# EAGLE schematic shield v1 (EAGLE 5.07)
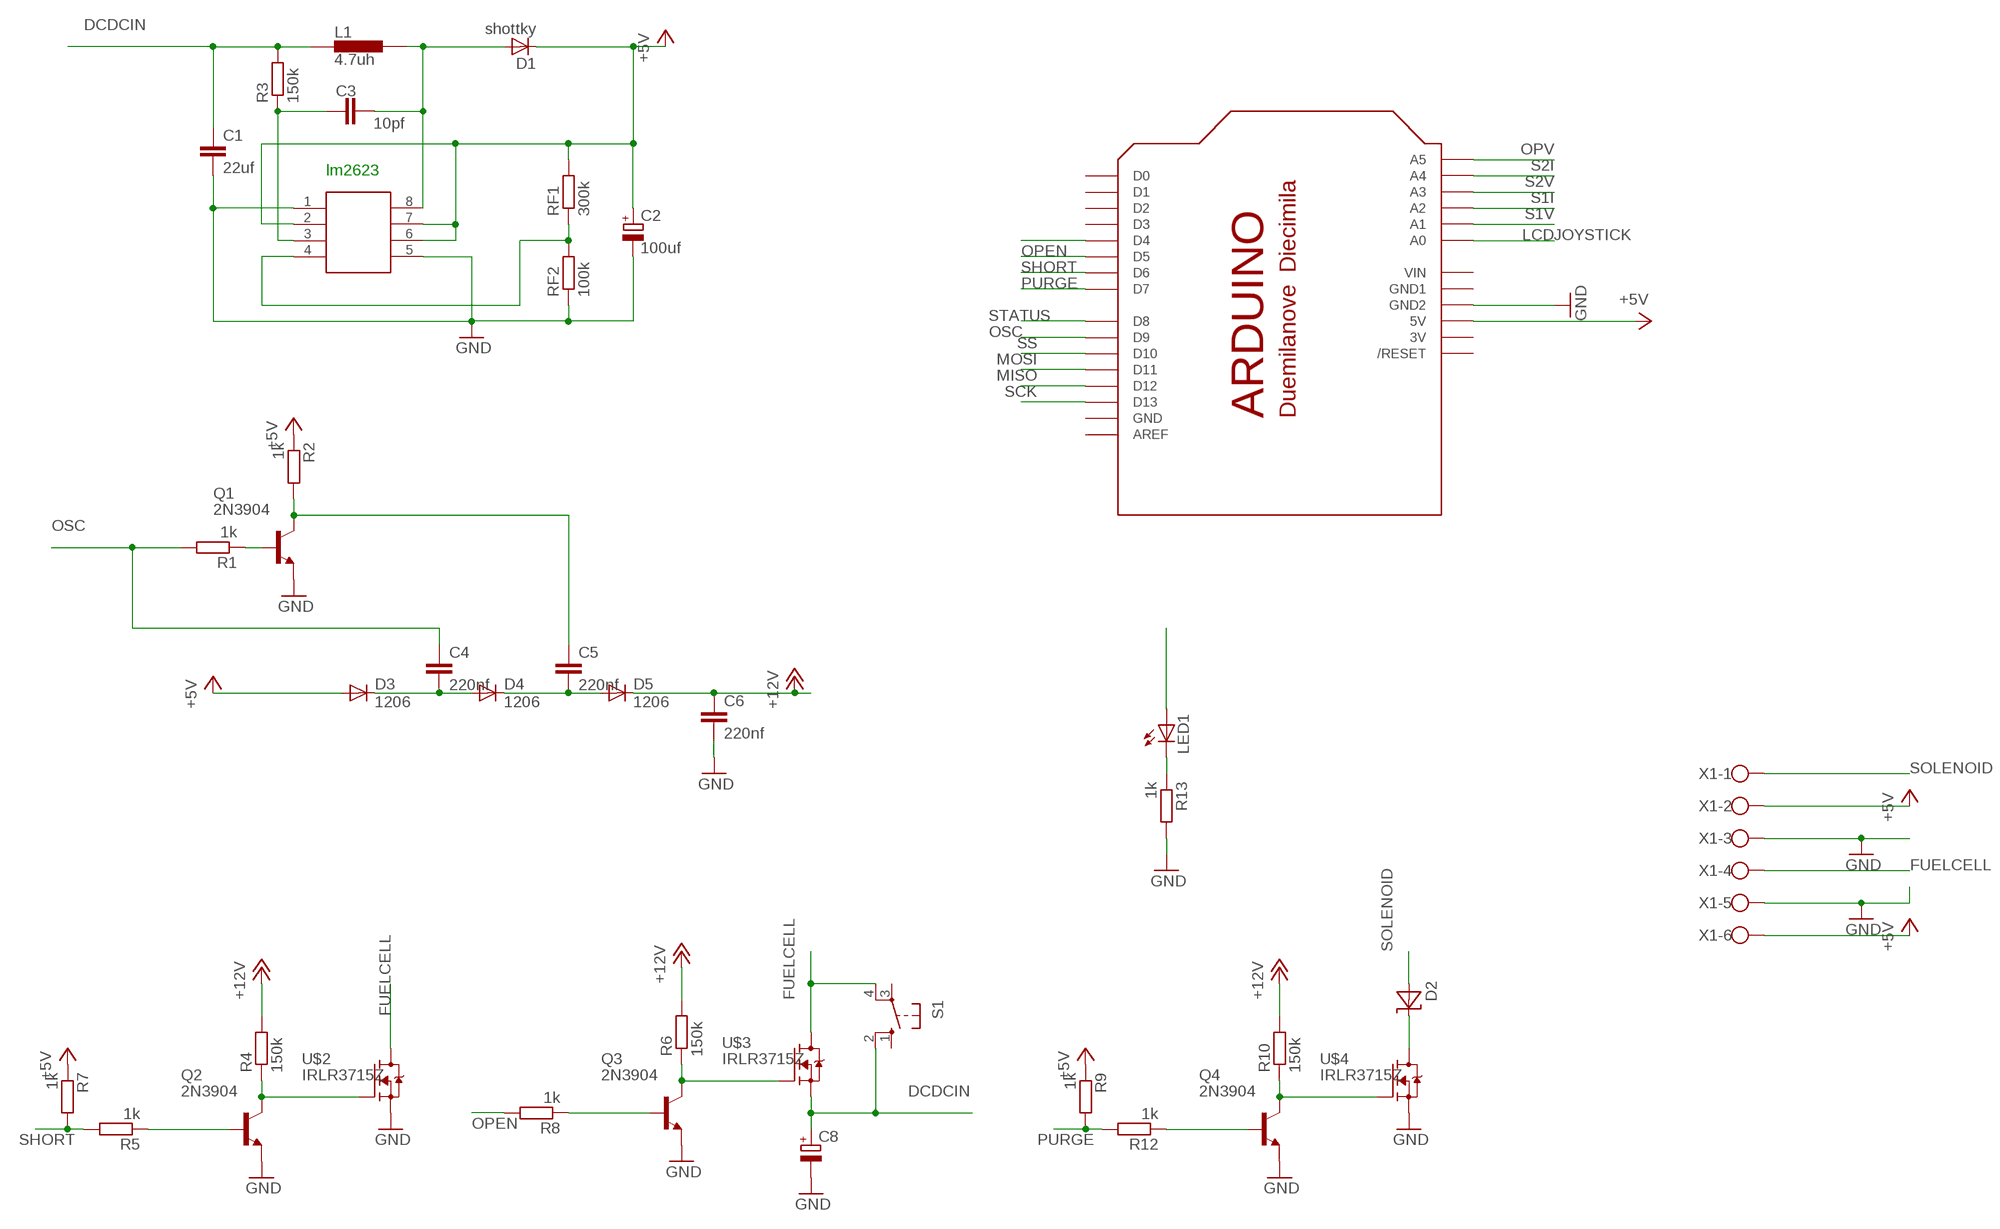
[diagram p0: schematic, sheet 1]

## Parts
C1  22uf  C-EUC1206  [C1206]
C2  100uf  CPOL-EUD  [PANASONIC_D]
C3  10pf  C-EUC1206  [C1206]
C4  220nf  C-EUC1206  [C1206]
C5  220nf  C-EUC1206  [C1206]
C6  220nf  C-EUC1206  [C1206]
C8  CPOL-EUE5-10.5  [E5-10,5]
D1  shottky  BYS10  [SOD106A]
D2  1206ZENER  [C1206]
D3  1206  [C1206]
D4  1206  [C1206]
D5  1206  [C1206]
L1  4.7uh  SMT-INDUCTOR  [SMT-INDUCTOR]
LED1  LED5MM  [LED5MM]
LM2623  lm2623  MINI-SO  [MINI-SO]
Q1  2N3904  [TO92]
Q2  2N3904  [TO92]
Q3  2N3904  [TO92]
Q4  2N3904  [TO92]
R1  1k  R-EU_M1206  [M1206]
R2  1k  R-EU_M1206  [M1206]
R3  150k  R-EU_M1206  [M1206]
R4  150k  R-EU_M1206  [M1206]
R5  1k  R-EU_M1206  [M1206]
R6  150k  R-EU_M1206  [M1206]
R7  1k  R-EU_M1206  [M1206]
R8  1k  R-EU_M1206  [M1206]
R9  1k  R-EU_M1206  [M1206]
R10  150k  R-EU_M1206  [M1206]
R12  1k  R-EU_M1206  [M1206]
R13  1k  R-EU_M1206  [M1206]
RF1  300k  R-EU_M1206  [M1206]
RF2  100k  R-EU_M1206  [M1206]
S1  10-XX  [B3F-10XX]
U$1  ARDUINO-BPLACE  [ARDUINO-BPLACE]
U$2  IRLR3715Z  [TO252]
U$3  IRLR3715Z  [TO252]
U$4  IRLR3715Z  [TO252]
X1  W237-6  [W237-6]

## Nets
+5V: C2.+ D1.K D3.ANODE(A) LM2623.2 LM2623.6 LM2623.7 R2.1 R7.1 R9.1 RF1.2 U$1.5V X1.2 X1.6
+12V: C6.1 D5.CATHODE(C) R4.2 R6.2 R10.2
DCDCIN: C1.1 C8.+ L1.P$2 R3.2 S1.2(S1) U$3.2(S)
FUELCELL: S1.4(P1) U$2.3(D) U$3.3(D) X1.4
GND: C1.2 C2.- C6.2 C8.- LM2623.1 LM2623.5 Q1.3(E) Q2.3(E) Q3.3(E) Q4.3(E) R13.2 RF2.1 U$1.GND2 U$2.2(S) U$4.2(S) X1.3 X1.5
LCDJOYSTICK: U$1.A0
MISO: U$1.D12
MOSI: U$1.D11
N$1: C3.1 LM2623.3 R3.1
N$2: Q4.1(C) R10.1 U$4.1(G)
N$3: LM2623.4 RF1.1 RF2.2
N$4: U$1.D7
N$5: Q2.1(C) R4.1 U$2.1(G)
N$6: C4.2 D3.CATHODE(C) D4.ANODE(A)
N$7: C5.2 D4.CATHODE(C) D5.ANODE(A)
N$8: Q4.2(B) R12.1
N$9: C3.2 D1.A L1.P$3 LM2623.8
N$10: D2.CATHODE(C) U$4.3(D)
N$11: C5.1 Q1.1(C) R2.2
N$12: Q1.2(B) R1.1
N$13: Q3.1(C) R6.1 U$3.1(G)
N$14: Q2.2(B) R5.1
N$15: LED1.K(C) R13.1
N$16: Q3.2(B) R8.1
OPEN: R8.2 U$1.D4
OPV: U$1.A5
OSC: C4.1 R1.2 U$1.D9
PURGE: R9.2 R12.2 U$1.D6
S1I: U$1.A2
S1V: U$1.A1
S2I: U$1.A4
S2V: U$1.A3
SCK: U$1.D13
SHORT: R5.2 R7.2 U$1.D5
SOLENOID: D2.ANODE(A) X1.1
SS: U$1.D10
STATUS: LED1.A U$1.D8
Unconnected: S1.1(S) S1.3(P) U$1.AREF U$1.D0 U$1.D1 U$1.D2 U$1.D3 U$1.RESET(/RESET)

## Notes on the sheet
- lm2623

## Power pins joined to a net without a drawn wire
3V: U$1.3V
GND: U$1.GND
GND1: U$1.GND1
VIN: U$1.VIN

## Library data of the parts
C1 C4-C6 = resistor:C-EU: CAPACITOR, European symbol
C2 C8 = matt rcl:CPOL-EU: POLARIZED CAPACITOR, European symbol
C3 = matt rcl:C-EU: CAPACITOR, European symbol
D1 = telefunken:BYS10: DIODE
D2 = matt diode:1206ZENER
D3-D5 = matt diode:1206
L1 = matt:SMT-INDUCTOR
LED1 = matt led:LED: LED OSRAM: - CHIPLED LG R971, LG N971, LY N971, LG Q971, LY Q971, LO R971, LY R971 LH N974, LH R974 LS Q976, LO Q976, LY Q976 LO Q996 - Hyper CHIPLED LW Q18S LB Q993, LB Q99A, LB R99A - SideLED LS A670, LO A670, LY A670, LG A670, LP A670 LB A673, LV A673, LT A673, LW A673 LH A674 LY A675 LS A676, LA A676, LO A676, LY A676, LW A676 LS A679, LY A679, LG A679 - Hyper Micro SIDELED® LS Y876, LA Y876, LO Y876, LY Y876 LT Y87S - SmartLED LW L88C, LW L88S LB L89C, LB L89S, LG L890 LS L89K, LO L89K, LY L89K LS L896, LA L896, LO L896, LY L896 - TOPLED LS T670, LO T670, LY T670, LG T670, LP T670 LSG T670, LSP T670, LSY T670, LOP T670, LYG T670 LG T671, LOG T671, LSG T671 LB T673, LV T673, LT T673, LW T673 LH T674 LS T676, LA T676, LO T676, LY T676, LB T676, LH T676, LSB T676, LW T676 LB T67C, LV T67C, LT T67C, LS T67K, LO T67K, LY T67K, LW E67C LS E67B, LA E67B, LO E67B, LY E67B, LB E67C, LV E67C, LT E67C LW T67C LS T679, LY T679, LG T679 LS T770, LO T770, LY T770, LG T770, LP T770 LB T773, LV T773, LT T773, LW T773 LH T774 LS E675, LA E675, LY E675, LS T675 LS T776, LA T776, LO T776, LY T776, LB T776 LHGB T686 LT T68C, LB T68C - Hyper Mini TOPLED® LB M676 - Mini TOPLED Santana® LG M470 LS M47K, LO M47K, LY M47K Source: http://www.osram.convergy.de LUXEON: - LUMILED® LXK2-PW12-R00, LXK2-PW12-S00, LXK2-PW14-U00, LXK2-PW14-V00 LXK2-PM12-R00, LXK2-PM12-S00, LXK2-PM14-U00 LXK2-PE12-Q00, LXK2-PE12-R00, LXK2-PE12-S00, LXK2-PE14-T00, LXK2-PE14-U00 LXK2-PB12-K00, LXK2-PB12-L00, LXK2-PB12-M00, LXK2-PB14-N00, LXK2-PB14-P00, LXK2-PB14-Q00 LXK2-PR12-L00, LXK2-PR12-M00, LXK2-PR14-Q00, LXK2-PR14-R00 LXK2-PD12-Q00, LXK2-PD12-R00, LXK2-PD12-S00 LXK2-PH12-R00, LXK2-PH12-S00 LXK2-PL12-P00, LXK2-PL12-Q00, LXK2-PL12-R00 Source: www.luxeon.com KINGBRIGHT: KA-3528ASYC Source: www.kingbright.com
LM2623 = matt smd-special:MINI-SO: Mini-SO generic format
Q1-Q4 = matt transistor-npn:2N3904: NPN Transistor
R1-R10 R12 R13 RF1 RF2 = resistor:R-EU_: RESISTOR, European symbol
S1 = switch-omron:10-XX: OMRON SWITCH
U$1 = adafruit:ARDUINO: Arduino Diecimila/Duemilanove Make a shield with ease, this package has all the named pins as well as the two mounting drill holes and an outline of the USB and DC power connector. The outline is on the DIMENSION layer, so if your board house uses it they will cut the outline to match. http://www.ladyada.net/library/pcb/eaglelibrary.html
U$2-U$4 = matt transistor-fet:IRLR3715Z
X1 = matt con-wago-500:W237-6: WAGO SCREW CLAMP